# Altium schematic sheet Volant5.Back_Button_v1.0.SchDoc
size A4
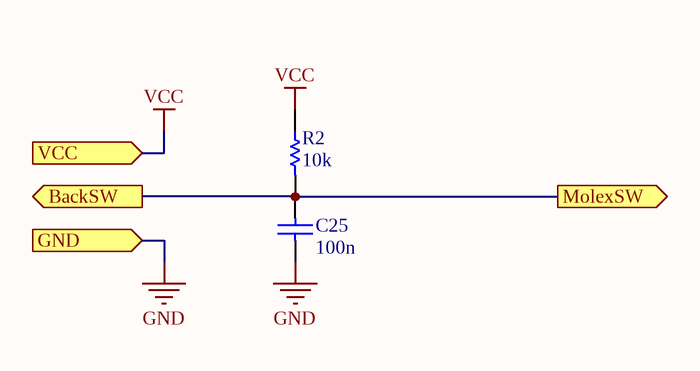
[diagram p0: Volant5.Back_Button_v1.0.SchDoc]

## Parts
C25  value 100n  [CS-0603]  (hidden comment: CS - CAPACITOR)
R2  value 10k  [RS-0603]  (hidden comment: RS - RESISTOR)

## Ports
BackSW (out), GND (in), MolexSW (out), VCC (in)

## Nets
GND: C25.1 ; port GND
VCC: R2.1 ; port VCC
BackSW: C25.2 R2.2 ; port BackSW, port MolexSW

## Library data of the parts
C25 = CS - CAPACITOR: VOLTAGE: 16V; TOLERANCE: 10%; Supplier 1: *; Supplier Part Number 1: 490-1532-1-ND; (FIELD A): *; (FLIED C): *; (FIELD B): *; Manufacturer: *
R2 = RS - RESISTOR: POWER: RES POWER; TOLERANCE: RES TOL; Supplier Part Number 1: RHM10.0KCFCT-ND; Supplier 1: *; (FIELD A): *; (FLIED C): *; (FIELD B): *; Manufacturer: *